# Altium schematic sheet [2] Bypass Balance.SchDoc
size A4; DocumentNumber: 2; SheetNumber: 2
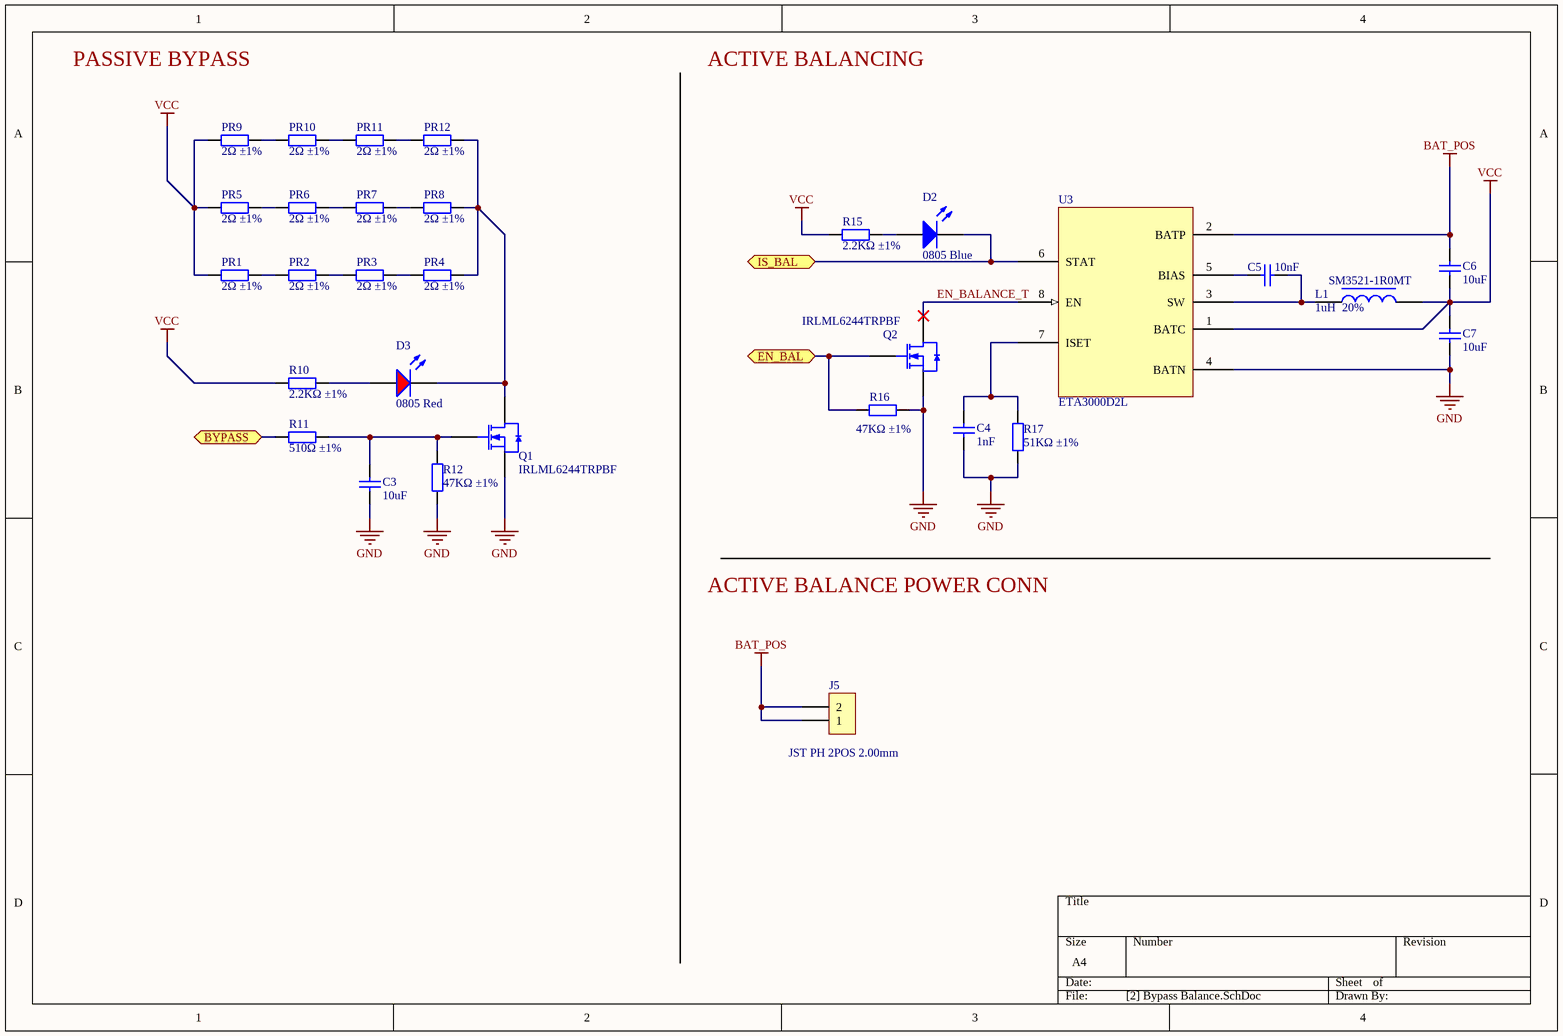
[diagram p0: [2] Bypass Balance.SchDoc]

## Parts
C3  10uF  [0805_C]
C4  1nF  [0805_C]
C5  10nF  [0805_C]
C6  10uF  [0805_C]
C7  10uF  [0805_C]
D2  0805 Blue  [0805_LED_S1]
D3  0805 Red  [0805_LED_S1]
J5  JST PH 2POS 2.00mm  [JST_PH_S2B]
L1  SM3521-1R0MT  Tolerance: 20%  Inductance: 1uH  [3521_L]
PR1  2Ω ±1%  [2512_R]
PR2  2Ω ±1%  [2512_R]
PR3  2Ω ±1%  [2512_R]
PR4  2Ω ±1%  [2512_R]
PR5  2Ω ±1%  [2512_R]
PR6  2Ω ±1%  [2512_R]
PR7  2Ω ±1%  [2512_R]
PR8  2Ω ±1%  [2512_R]
PR9  2Ω ±1%  [2512_R]
PR10  2Ω ±1%  [2512_R]
PR11  2Ω ±1%  [2512_R]
PR12  2Ω ±1%  [2512_R]
Q1  IRLML6244TRPBF  [SOT-23(SOT-23-3)]
Q2  IRLML6244TRPBF  [SOT-23(SOT-23-3)]
R10  2.2KΩ ±1%  [0805_R]
R11  510Ω ±1%  [0805_R]
R12  47KΩ ±1%  [0805_R]
R15  2.2KΩ ±1%  [0805_R]
R16  47KΩ ±1%  [0805_R]
R17  51KΩ ±1%  [0805_R]
U3  ETA3000D2L  [DFN2x2-8L]

## Ports
BYPASS (bidir), EN_BAL (bidir), IS_BAL (bidir)

## Nets
BAT_POS: C6.2 J5.1 J5.2 U3.2(BATP)
GND: C3.1 C4.1 C7.1 Q1.2(S) Q2.2(S) R12.1 R16.1 R17.1 U3.4(BATN)
VCC: C6.1 C7.2 L1.2 PR1.2 PR5.2 PR9.2 R10.2 R15.1 U3.1(BATC)
BYPASS: R11.1 ; port BYPASS
EN_BAL: Q2.1(G) R16.2 ; port EN_BAL
EN_BALANCE_T: Q2.3(D) U3.8(EN)
IS_BAL: D2.K U3.6(STAT) ; port IS_BAL
NetC3_2: C3.2 Q1.1(G) R11.2 R12.2
NetC4_2: C4.2 R17.2 U3.7(ISET)
NetC5_1: C5.1 L1.1 U3.3(SW)
NetC5_2: C5.2 U3.5(BIAS)
NetD2_A: D2.A R15.2
NetD3_A: D3.A R10.1
NetD3_K: D3.K PR4.1 PR8.1 PR12.1 Q1.3(D)
NetPR1_1: PR1.1 PR2.2
NetPR2_1: PR2.1 PR3.2
NetPR3_1: PR3.1 PR4.2
NetPR5_1: PR5.1 PR6.2
NetPR6_1: PR6.1 PR7.2
NetPR7_1: PR7.1 PR8.2
NetPR9_1: PR9.1 PR10.2
NetPR10_1: PR10.1 PR11.2
NetPR11_1: PR11.1 PR12.2

## Notes on the sheet
- PASSIVE BYPASS
- ACTIVE BALANCING
- ACTIVE BALANCE POWER CONN

## Library data of the parts
C3 C6 C7 = 0805 10uF (106) 10% 25V: Chip capacitors; Manufacturer: Samsung Electro-Mechanics; PartNumber: CL21A106KAYNNNE; Tolerance: 10%; Voltage: 25V; ComponentLink1Description: Supplier link; ComponentLink1URL: http://www.szlcsc.com/product/details_16532.html; Package: 0805; Supplier: LC; SuppliersPartNumber: C15850; Capacitance: 10uF
C4 = 0805 1nF (102) 10% 50V: Chip capacitors; Manufacturer: Samsung Electro-Mechanics; PartNumber: CL21B102KBCNNNC; Tolerance: 10%; Voltage: 50V; ComponentLink1Description: Supplier link; ComponentLink1URL: http://www.szlcsc.com/product/details_52223.html; Package: 0805; Supplier: LC; SuppliersPartNumber: C46653; Capacitance: 1nF
C5 = 0805 10nF (103) 10% 50V: Chip capacitors; Manufacturer: Samsung Electro-Mechanics; PartNumber: CL21B103KBANNNC; Tolerance: 10%; Voltage: 50V; ComponentLink1Description: Supplier link; ComponentLink1URL: http://www.szlcsc.com/product/details_2062.html; Package: 0805; Supplier: LC; SuppliersPartNumber: C1710; Capacitance: 10nF
D2 = 0805 LED Blue: LED; ComponentLink1Description: 供应商链接; ComponentLink1URL: http://www.szlcsc.com/product/details_2666.html; Package: 0805; Supplier: LC; SuppliersPartNumber: C2293; Color: Blue
D3 = 0805 LED Red: LED; PartNumber: FC-2012HRK-620D; Manufacturer: Foshan NationStar Optoelectronics; ComponentLink1Description: 供应商链接; ComponentLink1URL: http://www.szlcsc.com/product/details_2668.html; Package: 0805; Supplier: LC; SuppliersPartNumber: C84256; Color: Red
J5 = JST_PH_2POS: JST-PH Conn; Manufacturer: JST Sales America; PartNumber: S2B-PH-K-S(LF)(SN); Positions: 2; Row: 1; ComponentLink1Description: Datasheet; ComponentLink1URL: https://datasheet.lcsc.com/szlcsc/JST-Sales-America-S2B-PH-K-S-LF-SN_C173752.pdf; Supplier: LC; Type: Male; Notepad: *; SuppliersPartNumber: C173752; ComponentLink2Description: Supplier link; ComponentLink2URL: https://lcsc.com/product-detail/Wire-To-Board-Wire-To-Wire-Connector_JST-Sales-America-S2B-PH-K-S-LF-SN_C173752.html
L1 = 3521 1uH 20%: Power Inductor; Manufacturer: Shun Xiang Nuo Elec; Current: 2.2A; ComponentLink1Description: Supplier link; ComponentLink1URL: https://lcsc.com/product-detail/Power-Inductors_Shun-Xiang-Nuo-Elec-SM3521-1R0MT_C55366.html; Package: 3521; Supplier: LC; SuppliersPartNumber: C55366; PartNumber: SM3521-1R0MT
PR1-PR12 = 2512 2R (2R00) 1%: Chip resistor; Manufacturer: Uniroyal Elec; PartNumber: 25121WF200KT4E; Power: 1W; ComponentLink1Description: Supplier link; ComponentLink1URL: https://lcsc.com/product-detail/Chip-Resistor-Surface-Mount_Uniroyal-Elec-25121WF200KT4E_C49298.html; Package: 2512; Supplier: LC; SuppliersPartNumber: C49298; Resistance: 2Ω; Tolerance: 1%
Q1 Q2 = IRLML6244: MOSFET-N; Manufacturer: Infineon Technologies; ComponentLink1Description: Supplier Link; ComponentLink1URL: https://lcsc.com/product-detail/MOSFET_Infineon-Technologies-IRLML6244TRPBF_C143946.html; Package: SOT-23(SOT-23-3); Supplier: LC; SuppliersPartNumber: C143946; PartNumber: IRLML6244TRPBF
R10 R15 = 0805 2.2K (2201) 1%: Chip resistor; Manufacturer: Uniroyal Elec; PartNumber: 0805W8F2201T5E; Power: 1/8W; ComponentLink1Description: Supplier link; ComponentLink1URL: http://www.szlcsc.com/product/details_18208.html; Package: 0805; Supplier: LC; SuppliersPartNumber: C17520; Resistance: 2.2KΩ; Tolerance: 1%
R11 = 0805 510R (5100) 1%: Chip resistor; Manufacturer: Uniroyal Elec; PartNumber: 0805W8F5100T5E; Power: 1/8W; ComponentLink1Description: Supplier link; ComponentLink1URL: http://www.szlcsc.com/product/details_18422.html; Package: 0805; Supplier: LC; SuppliersPartNumber: C17734; Resistance: 510Ω; Tolerance: 1%
R12 R16 = 0805 47K (4702) 1%: Chip resistor; Manufacturer: Uniroyal Elec; PartNumber: 0805W8F4702T5E; Power: 1/8W; ComponentLink1Description: Supplier link; ComponentLink1URL: http://www.szlcsc.com/product/details_18401.html; Package: 0805; Supplier: LC; SuppliersPartNumber: C17713; Resistance: 47KΩ; Tolerance: 1%
R17 = 0805 51K (5102) 1%: Chip resistor; Manufacturer: Uniroyal Elec; PartNumber: 0805W8F5102T5E; Power: 1/8W; ComponentLink1Description: Supplier link; ComponentLink1URL: http://www.szlcsc.com/product/details_18425.html; Package: 0805; Supplier: LC; SuppliersPartNumber: C17737; Resistance: 51KΩ; Tolerance: 1%
U3 = ETA3000: Inductive Cell Balancer IC; Manufacturer: ETA Solutions; ComponentLink1Description: Datasheet; ComponentLink1URL: https://www.google.com/url?sa=t&rct=j&q=&esrc=s&source=web&cd=1&cad=rja&uact=8&ved=2ahUKEwiT6tKR3dXlAhUi_CoKHWUtB6cQFjAAegQIARAC&url=http%3A%2F%2Fwww.etasolution.com%2Fupload%2F201905%2F09%2F201905091810050738.pdf&usg=AOvVaw3laEeLP183Kq2gxYTbdcOz; PartNumber: ETA3000D2L; Supplier: *; SuppliersPartNumber: *; Package: DFN2x2-8